# EAGLE design Sensor_Board_0x06_CO2_S8_v1 (EAGLE 8.2.2)
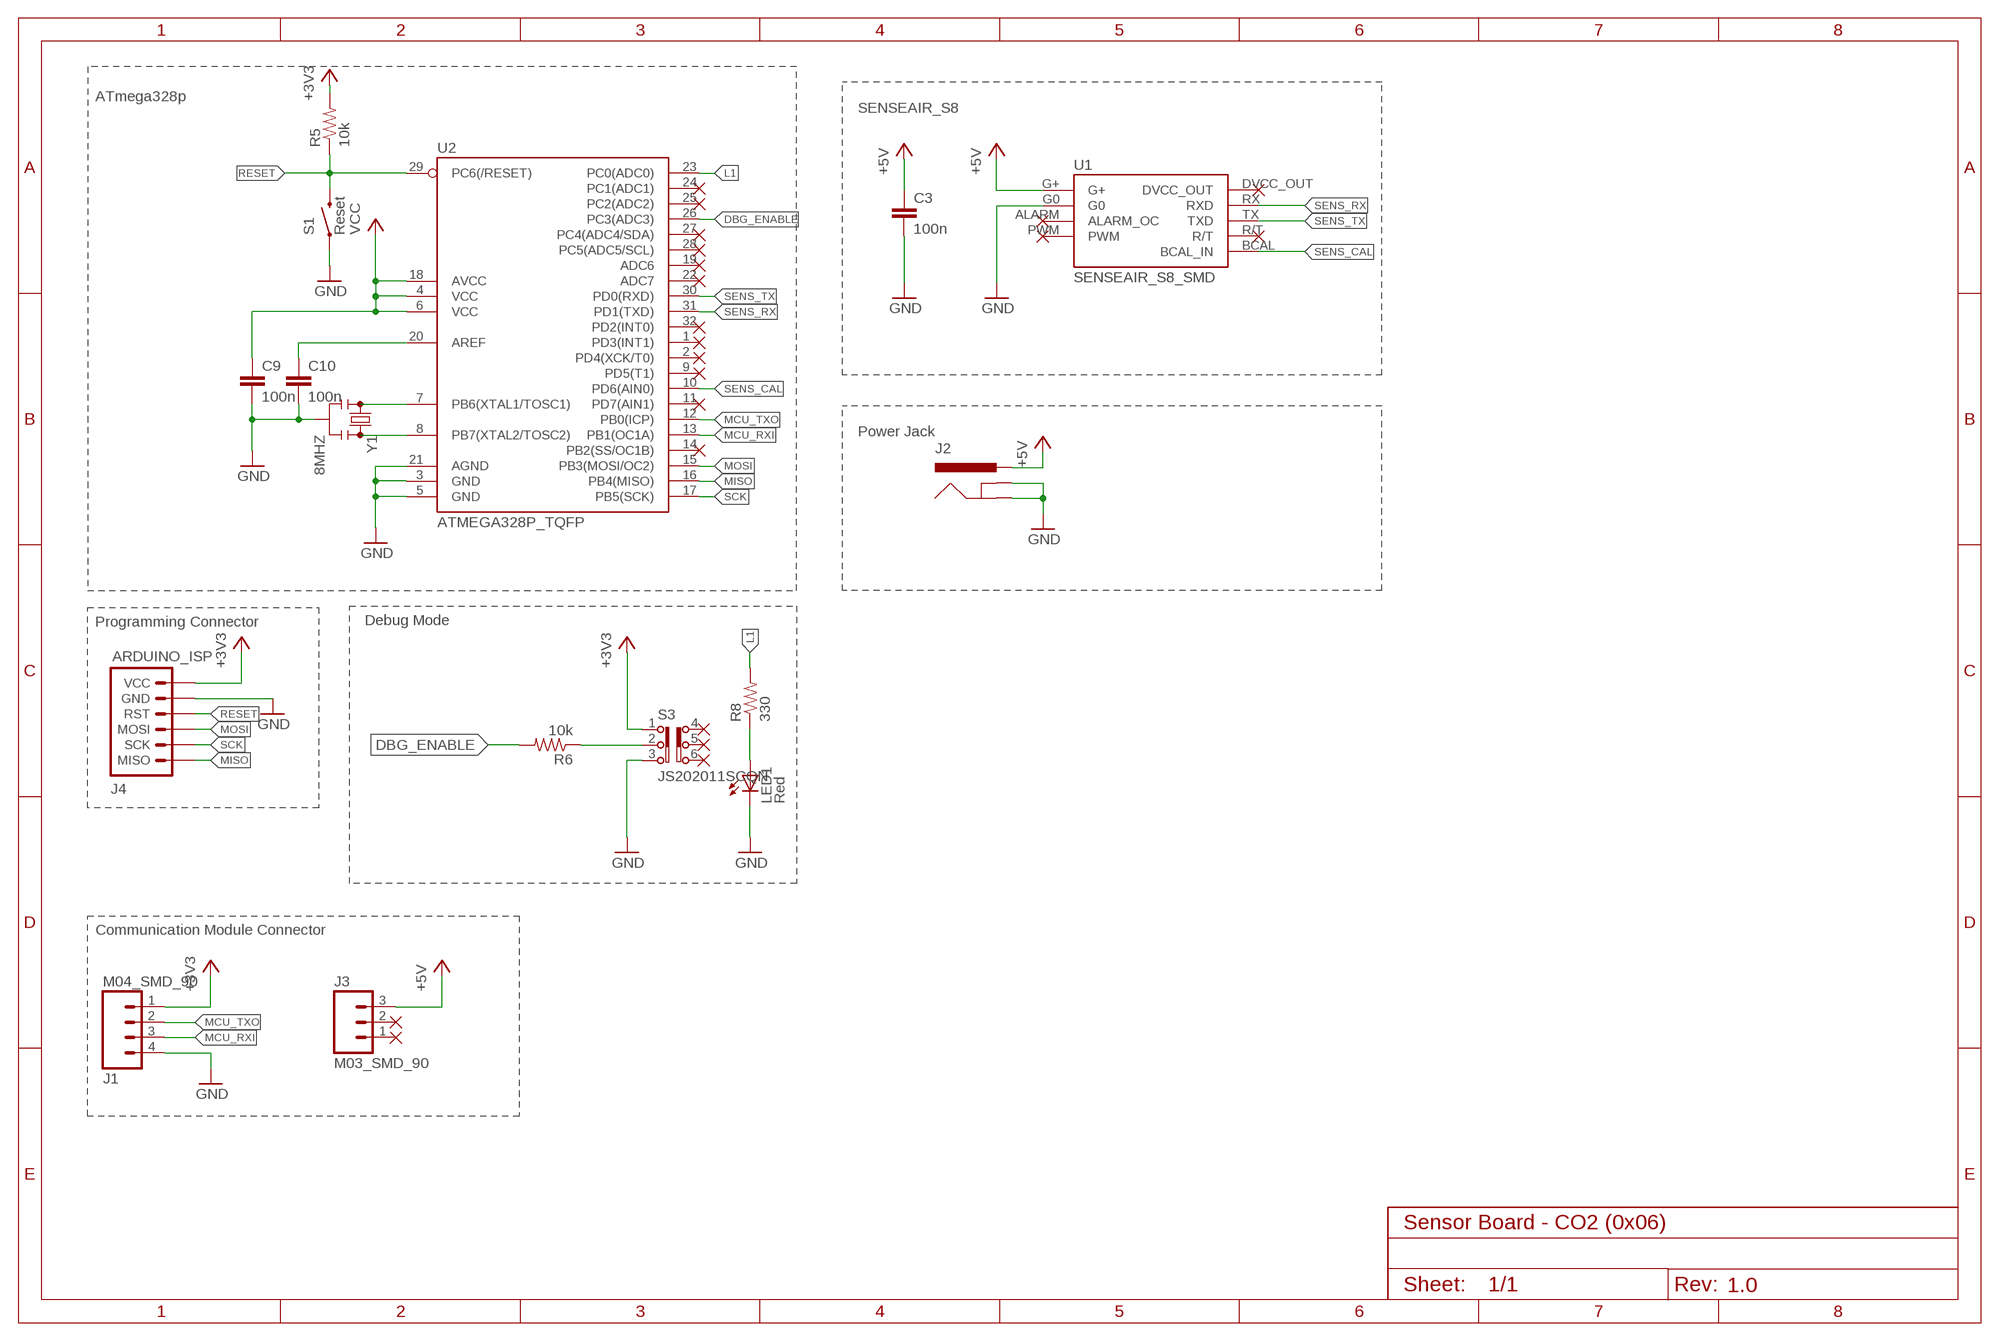
[diagram p0: schematic, sheet 1]
FRAME1 (FRAME-A4L): CNAME: Communication Module; CREVISION: 2.0

## Parts
C3  100n  C  [C0805]
C9  100n  C  [C0805]
C10  100n  C  [C0805]
J1  M04_SMD_90  [M04_SMD_90]
J2  5.5x2.1mm Barrel  POWER_JACKSMD  [POWER_JACK_SMD]
J3  M03_SMD_90  [M03_SMD_90]
J4  ARDUINO_ISP  [M-2X3]
LED1  Red  LEDSML0805  [SML0805]
R5  10k  RESISTOR0805-RES  [0805]
R6  10k  RESISTOR0805-RES  [0805]
R8  330  RESISTOR0805-RES  [0805]
S1  Reset  PUSHBUTTON  [M-PUSHBUTTON-SMD]
S3  JS202011SCQN  [JS202011SCQN]
U1  SENSEAIR_S8_SMD  [SENSEAIR_S8_SMD]
U2  ATMEGA328P_TQFP  [TQFP32-08]
Y1  8MHZ  RESONATOR8MHZ  [RESONATOR-SMD]

## Nets
+3V3 [Vsupply]: C9.1 J1.1 J4.P$6(VCC) R5.2 S3.1 U2.4(VCC) U2.6(VCC) U2.18(AVCC) ; supply symbol labelled VCC
+5V [Vsupply]: C3.1 J2.VIN0(PWR) J2.VIN1(PWR) J3.3 U1.G+
DBG_ENABLE: R6.2 U2.26(PC3(ADC3))
GND [GND]: C3.2 C9.2 C10.2 J1.4 J2.GND(GNDBREAK) J2.P$4(GND) J4.P$5(GND) LED1.C S1.1(LEFT) S1.2(LEFT) S3.3 U1.G0 U2.3(GND) U2.5(GND) U2.21(AGND) Y1.2
L1: R8.2 U2.23(PC0(ADC0))
MCU_RXI: J1.3 U2.13(PB1(OC1A))
MCU_TXO: J1.2 U2.12(PB0(ICP))
MISO: J4.P$1(MISO) U2.16(PB4(MISO))
MOSI: J4.P$3(MOSI) U2.15(PB3(MOSI/OC2))
N$1: U2.8(PB7(XTAL2/TOSC2)) Y1.3
N$2: U2.7(PB6(XTAL1/TOSC1)) Y1.1
N$4: R6.1 S3.2
N$15: C10.1 U2.20(AREF)
N$30: LED1.A R8.1
RESET: J4.P$4(RST) R5.1 S1.3(RIGHT) S1.4(RIGHT) U2.29(PC6(/RESET))
SCK: J4.P$2(SCK) U2.17(PB5(SCK))
SENS_CAL: U1.BCAL(BCAL_IN) U2.10(PD6(AIN0))
SENS_RX: U1.RX(RXD) U2.31(PD1(TXD))
SENS_TX: U1.TX(TXD) U2.30(PD0(RXD))
Unconnected: J3.1 J3.2 S3.4 S3.5 S3.6 U1.ALARM(ALARM_OC) U1.DVCC_OUT U1.PWM U1.R/T U2.1(PD3(INT1)) U2.2(PD4(XCK/T0)) U2.9(PD5(T1)) U2.11(PD7(AIN1)) U2.14(PB2(SS/OC1B)) U2.19(ADC6) U2.22(ADC7) U2.24(PC1(ADC1)) U2.25(PC2(ADC2)) U2.27(PC4(ADC4/SDA)) U2.28(PC5(ADC5/SCL)) U2.32(PD2(INT0))

## Notes on the sheet
- ATmega328p
- SENSEAIR_S8
- Power Jack
- Programming Connector | Debug Mode
- Communication Module Connector
- Sensor Board - CO2 (0x06)
- 1.0

## Library data of the parts
C3 C9 C10 = eagle-ltspice:C: CAPACITOR, European symbol; SPICEMODEL: NONE; SPICEPREFIX: C
J1 = myownthings:M04_SMD_90
J2 = wsn:POWER_JACK: Power Jack This is the standard 5.5mm barrel jack for power. The PTH is the most common, proven, reliable, footprint. The Slot footprint only works if the mill layer is transmitted to the PCB fab house so be warned. Mating wall wart : TOL-00298 (and others); PROD_ID: CONN-08106; SF_ID: PRT-12748
J3 = myownthings:M03_SMD_90
J4 = marc_library:ARDUINO_ISP: AVR ISP 6-pin inline header for Arduino ISP
LED1 = led:LED: LED OSRAM: - CHIPLED LG R971, LG N971, LY N971, LG Q971, LY Q971, LO R971, LY R971 LH N974, LH R974 LS Q976, LO Q976, LY Q976 LO Q996 - Hyper CHIPLED LW Q18S LB Q993, LB Q99A, LB R99A - SideLED LS A670, LO A670, LY A670, LG A670, LP A670 LB A673, LV A673, LT A673, LW A673 LH A674 LY A675 LS A676, LA A676, LO A676, LY A676, LW A676 LS A679, LY A679, LG A679 - Hyper Micro SIDELED® LS Y876, LA Y876, LO Y876, LY Y876 LT Y87S - SmartLED LW L88C, LW L88S LB L89C, LB L89S, LG L890 LS L89K, LO L89K, LY L89K LS L896, LA L896, LO L896, LY L896 - TOPLED LS T670, LO T670, LY T670, LG T670, LP T670 LSG T670, LSP T670, LSY T670, LOP T670, LYG T670 LG T671, LOG T671, LSG T671 LB T673, LV T673, LT T673, LW T673 LH T674 LS T676, LA T676, LO T676, LY T676, LB T676, LH T676, LSB T676, LW T676 LB T67C, LV T67C, LT T67C, LS T67K, LO T67K, LY T67K, LW E67C LS E67B, LA E67B, LO E67B, LY E67B, LB E67C, LV E67C, LT E67C LW T67C LS T679, LY T679, LG T679 LS T770, LO T770, LY T770, LG T770, LP T770 LB T773, LV T773, LT T773, LW T773 LH T774 LS E675, LA E675, LY E675, LS T675 LS T776, LA T776, LO T776, LY T776, LB T776 LHGB T686 LT T68C, LB T68C - Hyper Mini TOPLED® LB M676 - Mini TOPLED Santana® LG M470 LS M47K, LO M47K, LY M47K Source: http://www.osram.convergy.de LUXEON: - LUMILED® LXK2-PW12-R00, LXK2-PW12-S00, LXK2-PW14-U00, LXK2-PW14-V00 LXK2-PM12-R00, LXK2-PM12-S00, LXK2-PM14-U00 LXK2-PE12-Q00, LXK2-PE12-R00, LXK2-PE12-S00, LXK2-PE14-T00, LXK2-PE14-U00 LXK2-PB12-K00, LXK2-PB12-L00, LXK2-PB12-M00, LXK2-PB14-N00, LXK2-PB14-P00, LXK2-PB14-Q00 LXK2-PR12-L00, LXK2-PR12-M00, LXK2-PR14-Q00, LXK2-PR14-R00 LXK2-PD12-Q00, LXK2-PD12-R00, LXK2-PD12-S00 LXK2-PH12-R00, LXK2-PH12-S00 LXK2-PL12-P00, LXK2-PL12-Q00, LXK2-PL12-R00 Source: www.luxeon.com KINGBRIGHT: KA-3528ASYC Source: www.kingbright.com
R5 R6 R8 = SparkFun-Passives:RESISTOR: Resistor Basic schematic elements and footprints for 0603, 1206, and PTH resistors.
S1 = marc_library:PUSHBUTTON
S3 = myownthings:JS202011SCQN: DPDT SLIDE SWITCH
U1 = myownthings:SENSEAIR_S8_SMD
U2 = marc_library:ATMEGA328P_TQFP; PROD_ID: IC-09069
Y1 = marc_library:RESONATOR: Resonator Small SMD resonator. Used, eg, on the Arduino Pro/ Pro Mini boards. 8MHz- XTAL-08895 16MHz- XTAL-08900; PROD_ID: XTAL-08895

## Net classes
0 default: width 0.3 mm
1 Vsupply: width 0.5 mm
5 GND: width 0.5 mm

## Board
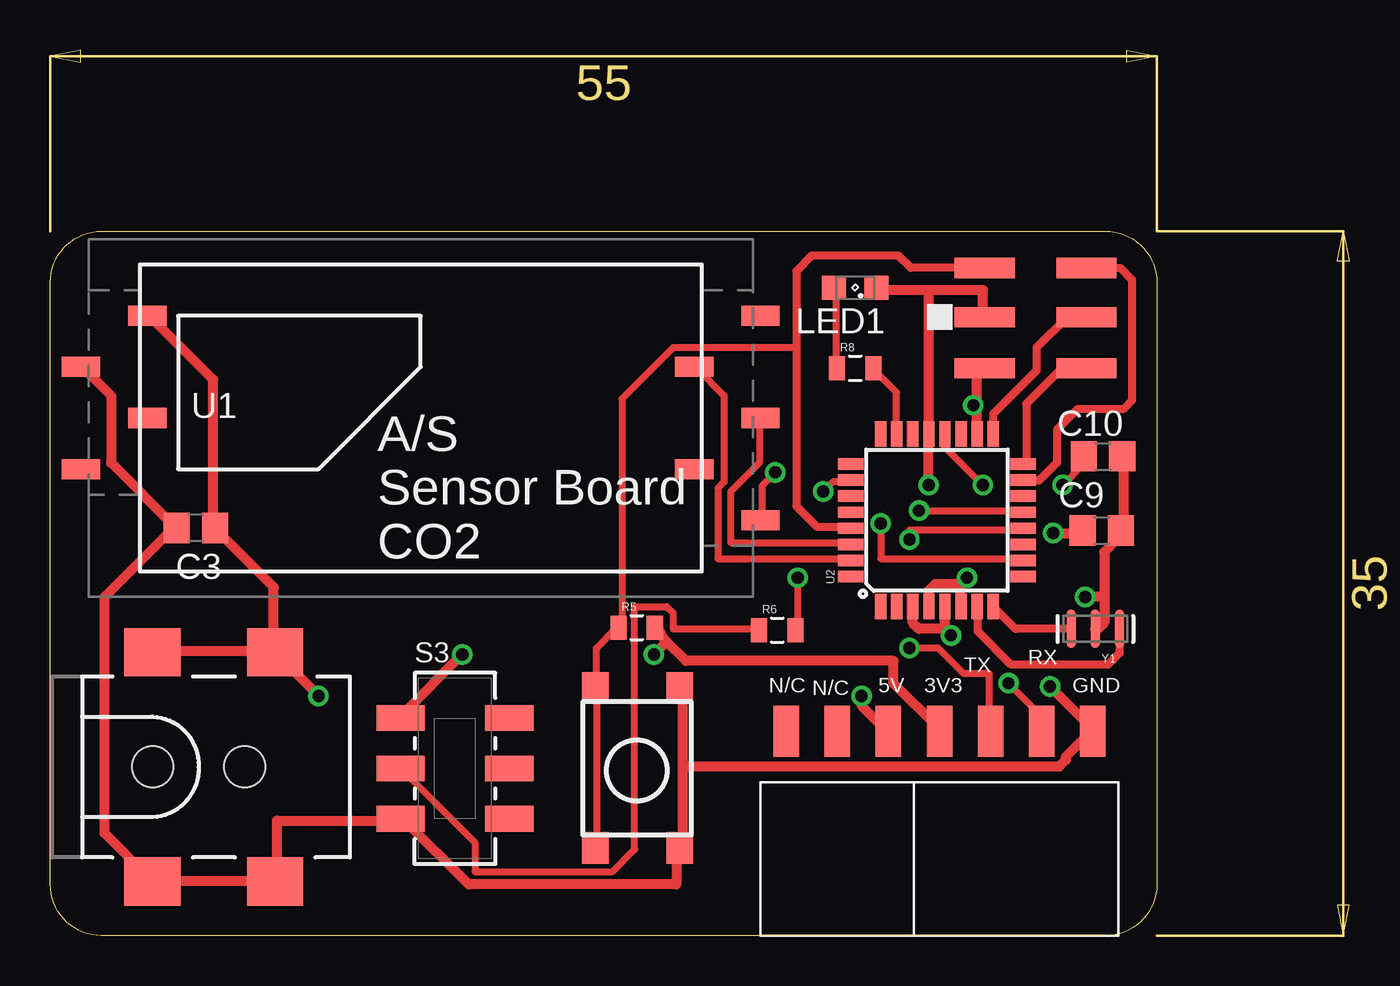
[diagram p1: board, top side]
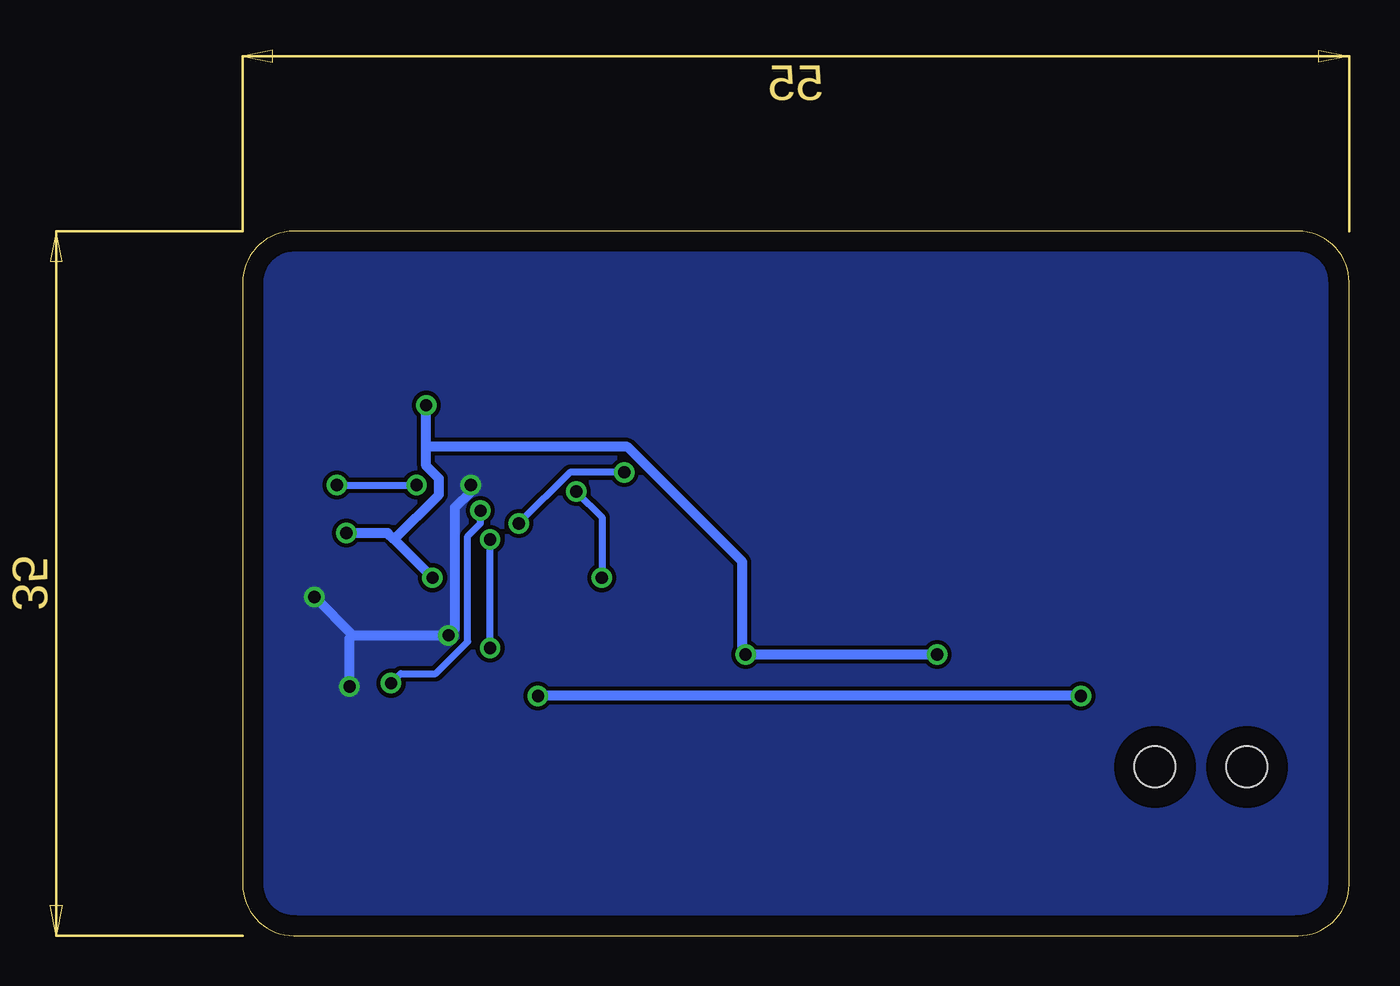
[diagram p2: board, bottom side, seen from below]

Size 55 x 35 mm. Coordinates in mm from the lower left corner, seen from the top.
Outline: 52.46,0 2.54,0 arc-90 0,2.54 0,32.46 arc-90 2.54,35 52.46,35 arc-90 55,32.46 55,2.54 arc-90 52.46,0
Copper layers (1*16): Top 0.035mm / dielectric 1.5mm / Bottom 0.035mm
Design rules "default *": minimum track width 14mil, minimum drill 24mil, track to track 8mil, track to pad 8mil, pad to pad 8mil, via to via 8mil, smd to smd 8mil, copper to edge 40mil, drill to drill 8mil, minimum pad ring 10mil, minimum via ring 8mil, stop-mask expansion 4mil, vias tented up to drill 0mil, thermal gap 10mil

### Footprints (pad centres in the part's own frame; a part is rotated, then mirrored left to right if it is on the bottom)
C0805 = smd 1.3 x 1.5: 1 -0.95,0; 2 0.95,0
M04_SMD_90 = smd 1.27 x 2.54: 1 0,0; 2 2.54,0; 3 5.08,0; 4 7.62,0
POWER_JACK_SMD = smd 2.8 x 2.4: GND 0,-5.7; P$4 6.1,-5.7; VIN0 0,5.7; VIN1 6.1,5.7 | hole 2.032: 0,0; 4.572,0
M03_SMD_90 = smd 1.27 x 2.54: 1 0,0; 2 2.54,0; 3 5.08,0
M-2X3 = smd 1 x 3: P$1 0,0; P$2 2.54,0; P$3 4.98,0; P$4 4.98,5.05; P$5 2.54,5.05; P$6 0,5.05
SML0805 = smd 1.2 x 1.2: A 1.05,0; C -1.05,0
0805 = smd 0.8 x 1.2: 1 -0.9,0; 2 0.9,0
M-PUSHBUTTON-SMD = smd 1.55 x 1.3: 1 0,0; 2 7.95,0; 3 0,-4.2; 4 7.95,-4.2
JS202011SCQN = smd 1.27 x 2.4: 1 -2.5,-2.7; 2 0,-2.7; 3 2.5,-2.7; 4 -2.5,2.7; 5 0,2.7; 6 2.5,2.7
SENSEAIR_S8_SMD = smd 1.91 x 1: ALARM -13.595,0; BCAL 16.885,-5.08; DVCC_OUT 16.885,5.08; G0 -16.885,2.54; G+ -13.595,5.08; PWM -16.885,-2.54; R/T 13.595,-2.54; RX 13.595,2.54; TX 16.885,0
TQFP32-08 = smd 1.27 x 0.559: 1 -4.293,2.8; 2 -4.293,2; 3 -4.293,1.2; 4 -4.293,0.4; 5 -4.293,-0.4; 6 -4.293,-1.2; 7 -4.293,-2; 8 -4.293,-2.8; 17 4.293,-2.8; 18 4.293,-2; 19 4.293,-1.2; 20 4.293,-0.4; 21 4.293,0.4; 22 4.293,1.2; 23 4.293,2; 24 4.293,2.8 | smd 0.559 x 1.27: 9 -2.8,-4.293; 10 -2,-4.293; 11 -1.2,-4.293; 12 -0.4,-4.293; 13 0.4,-4.293; 14 1.2,-4.293; 15 2,-4.293; 16 2.8,-4.293; 25 2.8,4.293; 26 2,4.293; 27 1.2,4.293; 28 0.4,4.293; 29 -0.4,4.293; 30 -1.2,4.293; 31 -2,4.293; 32 -2.8,4.293
RESONATOR-SMD = smd 0.45 x 1.905: 1 -1.2,0; 2 0,0; 3 1.2,0

### Placement (x,y rotation side)
C3  7.24,20.26 180 top
C9  52.26,20.13 0 top
C10  52.32,23.81 0 top
J1  44.2,10.16 0 top
J2  5.08,8.38 0 top
J3  36.58,10.16 0 top
J4  51.5,28.19 90 top
LED1  40.01,32.19 180 top
R5  29.15,15.3 0 top
R6  36.13,15.18 0 top
R8  40.01,28.19 0 top
S1  31.29,12.3 270 top
S3  20.11,8.31 270 top
U1  18.41,25.72 0 top
U2  44.07,20.64 90 top
Y1  51.94,15.24 180 top

### Tracks (layer width: path | path; a pad name or v marks a point on that pad's centre or on a via)
+3V3  (via drill 0.61)
  Top 0.5: 46.04,26.35 46.04,27.78 46.35,28.1 J4.P$6 | 46.04,26.35 46.04,25.08 U2.18 | 45.24,17.46 43.97,17.46 43.66,17.14 43.66,16.35 U2.4 | 45.24,17.46 45.24,16.35 U2.6 | v49.85,20 51.28,20 C9.1 | v45.56,17.78 45.24,17.46 | v45.88,26.35 46.04,26.35 | 30.64,14.61 31.59,13.65 41.91,13.65 41.91,12.54 44.13,10.32 44.13,10.16 J1.1 | 30.64,14.61 30.32,14.92 30.32,15.08 30.16,15.24 R5.2 | v20.48,13.97 17.46,10.95 S3.1 | 30.64,14.61 v30,13.97
  Bottom 0.5: v49.85,20 47.78,20 47.47,19.68 | v45.56,17.78 47.47,19.68 | 45.88,24.29 45.88,23.34 45.24,22.7 45.24,21.91 47.47,19.68 | 45.88,24.29 v45.88,26.35 | v20.48,13.97 v30,13.97 30.16,14.13 30.16,18.57 35.88,24.29 45.88,24.29
+5V  (via drill 0.61)
  Top 0.5: J2.VIN1 11.11,14.13 11.11,17.3 8.26,20.16 C3.1 8.1,20.48 8.1,27.62 4.92,30.8 U1.G+ | v40.32,11.91 40.32,11.43 41.59,10.16 J3.3 | v13.34,11.91 11.27,13.97 J2.VIN1 | J2.VIN0 5.08,14.13 10.95,14.13 J2.VIN1
  Bottom 0.5: v13.34,11.91 v40.32,11.91
DBG_ENABLE  (via drill 0.61)
  Top 0.356: v37.15,17.78 37.15,15.24 R6.2 | v38.42,22.07 38.89,22.54 39.69,22.54 U2.26
  Bottom 0.356: v37.15,17.78 37.15,20.8 v38.42,22.07
GND  (via drill 0.61)
  Top 0.5: U1.G0 1.59,28.26 3.02,26.83 3.02,23.5 6.19,20.32 C3.2 6.03,20.16 2.7,16.83 2.7,5.08 4.92,2.86 J2.GND 5.08,2.7 10.95,2.7 J2.P$4 11.27,2.7 11.27,5.71 17.3,5.71 S3.3 17.62,5.71 20.8,2.54 31.11,2.54 31.11,4.29 S1.2 31.43,4.45 31.43,8.41 | 43.66,32.07 46.35,32.07 46.35,30.8 J4.P$5 | 43.66,32.07 41.12,32.07 LED1.C | 43.66,32.07 43.66,25.08 U2.21 43.66,24.77 v43.66,22.38 | 44.45,15.24 43.18,15.24 42.86,15.56 42.86,16.19 U2.3 | 44.45,15.24 44.45,16.19 U2.5 | C10.2 53.34,23.81 53.34,20.16 C9.2 53.02,20 53.02,19.68 52.39,19.05 52.39,16.83 | 52.39,16.83 52.39,15.56 52.07,15.24 Y1.2 | 52.39,16.83 v51.44,16.83 | v44.77,14.92 44.45,15.24 | 31.43,8.41 31.43,12.22 S1.1 | 31.43,8.41 50.16,8.41 50.48,8.73 50.48,8.89 51.75,10.16 J1.4 51.59,10.32 51.59,10.48 v49.69,12.38
  Bottom 0.5: 49.53,14.92 v44.77,14.92 44.45,15.24 44.45,21.27 43.66,22.07 v43.66,22.38 | v51.44,16.83 49.53,14.92 | v49.69,12.38 49.69,14.76 49.53,14.92
  pour Bottom: 55,2.54 55,32.46 arc90 52.46,35 2.54,35 arc90 0,32.46 0,2.54 arc90 2.54,0 52.46,0 arc90
L1
  Top 0.356: R8.2 40.96,28.1 42.07,26.99 42.07,25.08 U2.23
MCU_RXI  (via drill 0.61)
  Top 0.356: v43.18,21.11 48.26,21.11 U2.13 | v47.62,12.54 49.21,10.95 49.21,10.16 J1.3
  Bottom 0.356: v43.18,21.11 43.18,20.48 43.81,19.84 43.81,14.61 45.4,13.02 47.15,13.02 v47.62,12.54
MCU_TXO  (via drill 0.61)
  Top 0.356: v42.7,19.68 42.7,20.16 48.26,20.16 U2.12 | v42.7,14.29 44.13,14.29 45.4,13.02 46.67,13.02 46.67,10.16 J1.2
  Bottom 0.356: v42.7,14.29 v42.7,19.68
MISO
  Top 0.406: J4.P$1 50.29,28.19 48.51,26.42 48.51,23.59 U2.16
MOSI
  Top 0.406: J4.P$3 53.19,33.17 53.77,32.59 53.77,26.59 53.34,26.16 51.05,26.16 50.04,25.15 50.04,23.5 49.15,22.61 48.39,22.61 U2.15
N$1
  Top 0.406: Y1.3 47.97,15.24 U2.8
N$2
  Top 0.406: Y1.1 53.14,14.03 52.58,13.46 47.75,13.46 46.1,15.11 46.1,16.31 U2.7
N$4
  Top 0.356: R6.1 35.08,15.24 30.96,15.24 30.96,16.03 30.64,16.35 29.05,16.35 29.05,4.29 27.94,3.17 21.11,3.17 21.11,4.6 17.46,8.26 S3.2
N$15  (via drill 0.61)
  Top 0.356: v46.35,22.38 44.45,24.29 44.45,24.92 U2.20 | v50.32,22.38 51.28,23.34 51.28,23.81 C10.1
  Bottom 0.356: v50.32,22.38 v46.35,22.38
N$30
  Top 0.356: R8.1 39.05,28.26 39.05,32.07 LED1.A
RESET
  Top 0.356: S1.4 27.15,4.45 27.15,12.22 S1.3 27.15,12.38 27.15,14.29 28.1,15.24 R5.1 28.26,15.4 28.42,15.56 28.42,26.67 30.96,29.21 37.08,29.21
  Top 0.406: J4.P$4 42.77,33.17 42.16,33.78 37.84,33.78 37.08,33.02 37.08,29.21 37.08,21.34 38.1,20.32 39.69,20.32 U2.29
SCK
  Top 0.406: J4.P$2 50.55,30.73 49.02,29.21 49.02,28.07 46.86,25.91 U2.17
SENS_CAL  (via drill 0.61)
  Top 0.356: v41.27,20.48 41.27,18.73 48.26,18.73 U2.10 | v36.04,23.02 35.4,22.38 35.4,20.64 U1.BCAL
  Bottom 0.356: v41.27,20.48 38.73,23.02 v36.04,23.02
SENS_RX
  Top 0.356: U2.31 39.69,18.73 33.18,18.73 33.18,22.23 33.5,22.54 33.5,26.83 32.07,28.26 U1.RX
SENS_TX
  Top 0.356: U2.30 39.69,19.53 33.81,19.53 33.81,22.07 35.24,23.5 35.24,25.72 U1.TX

### Text on the board
tPlace: A/S / Sensor Board / CO2 | TX | RX | N/C | N/C | 5V | 3V3 | GND